# EAGLE design esp-01-qwiic-devbrd-v1.0 (EAGLE 9.6.2)
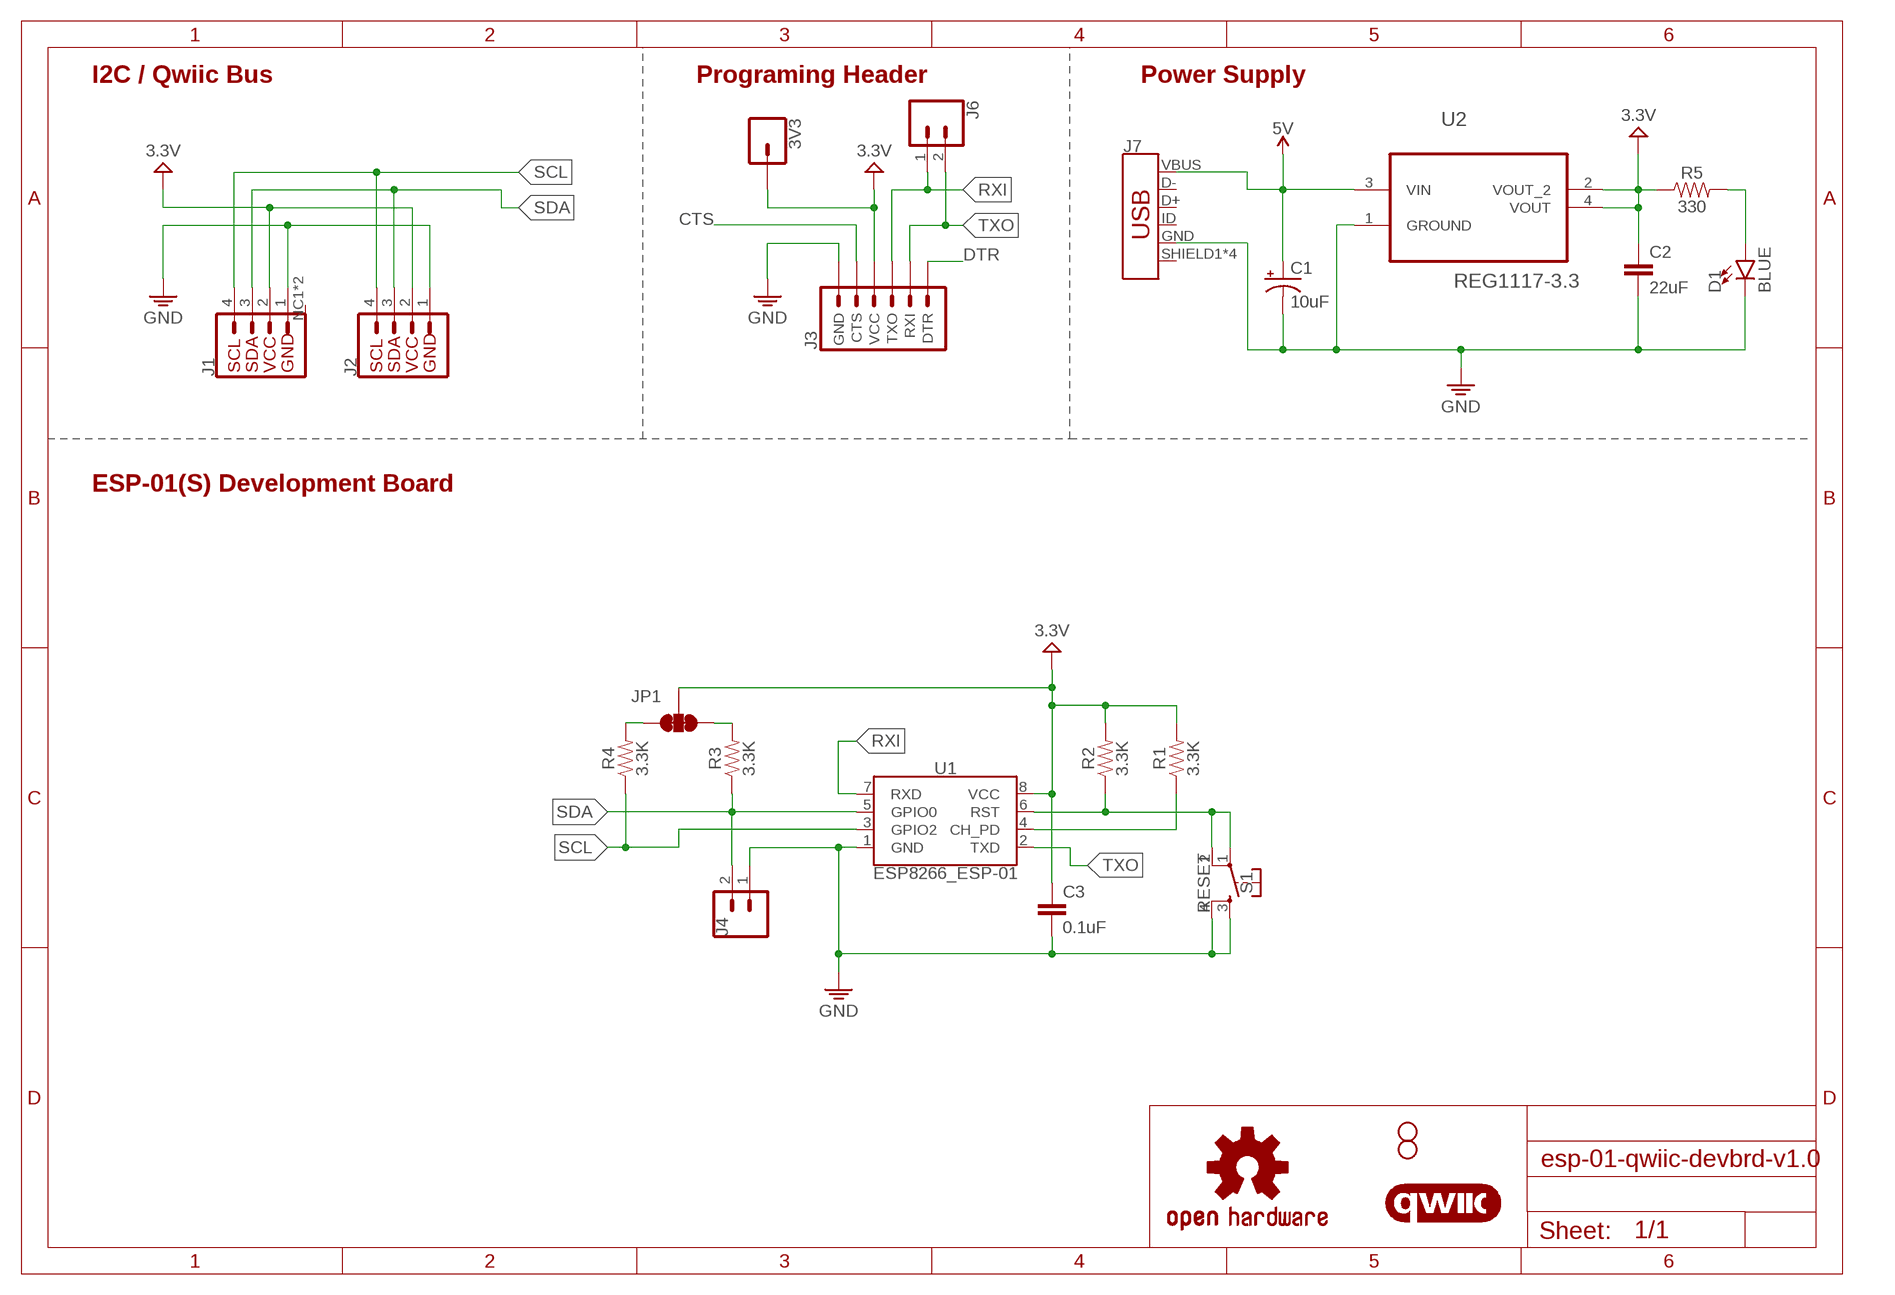
[diagram p0: schematic, sheet 1]

## Parts
3V3  CONN_01PTH_NO_SILK_YES_STOP  [1X01_NO_SILK]
C1  10uF  10UF-POLAR-EIA3216-16V-10%(TANT)  [EIA3216]
C2  22uF  22UF-0805-6.3V-20%  [0805]
C3  0.1uF  0.1UF-0603-25V-5%  [0603]
D1  BLUE  LED-BLUE0603  [LED-0603]
H1  STAND-OFF  [STAND-OFF]
H2  STAND-OFF  [STAND-OFF]
J1  QWIIC_CONNECTORJST04_1MM_RA_GND  [JST04_1MM_RA]
J2  I2C_STANDARD  [1X04]
J3  6_PIN_SERIAL_TARGETSILK  [6_PIN_SERIAL_TARGET_SIDE_W_SILK]
J4  CONN_02  [1X02]
J6  CONN_021X02_NO_SILK  [1X02_NO_SILK]
J7  USB_MICRO-B_FEMALE-SMT  [USB-B-MICRO-SMD]
JP1  JUMPER-SMT_3_2-NC_TRACE_SILK  [SMT-JUMPER_3_2-NC_TRACE_SILK]
LOGO1  OSHW-LOGOS  [OSHW-LOGO-S]
LOGO2  QWIIC_LOGO_6MM  [QWIIC_6MM]
R1  3.3K  RESISTOR0805  [0805]
R2  3.3K  RESISTOR0805  [0805]
R3  3.3K  RESISTOR0805  [0805]
R4  3.3K  RESISTOR0805  [0805]
R5  330  330OHM-0603-1/10W-1%  [0603]
S1  RESET  MOMENTARY-SWITCH-SPST-2-SMD-5.2MM  [TACTILE_SWITCH_SMD_5.2MM]
U1  ESP8266_ESP-01  [ESP8266_ESP-01]
U2  REG1117-3.3  [SOT230P700X180-4N]

## Nets
5V: C1.+ J7.VBUS U2.3(VIN)
CTS: J3.5(CTS)
DTR: J3.1(DTR)
GND: C1.- C2.2 C3.2 D1.C J1.1 J2.1 J3.6(GND) J4.1 J7.GND S1.3 S1.4 U1.1(GND) U2.1(GROUND)
N$3: R2.1 S1.1 S1.2 U1.6(RST)
N$4: D1.A R5.2
N$5: R1.1 U1.4(CH_PD)
N$6: JP1.3 R4.2
N$7: JP1.1 R3.2
RXI: J3.2(TXO) J6.1 U1.7(RXD)
SCL: J1.4 J2.4 R4.1 U1.3(GPIO2)
SDA: J1.3 J2.3 J4.2 R3.1 U1.5(GPIO0)
TXO: J3.3(RXI) J6.2 U1.2(TXD)
VCC: 3V3.1 C2.1 C3.1 J1.2 J2.2 J3.4(VCC) JP1.2 R1.2 R2.2 R5.1 U1.8(VCC) U2.2(VOUT_2) U2.4(VOUT) ; supply symbol labelled 3.3V
Unconnected: J1.NC1(SH) J1.NC2(SH) J7.D+ J7.D- J7.ID J7.SHIELD1(SHIELD) J7.SHIELD2(SHIELD) J7.SHIELD3(SHIELD) J7.SHIELD4(SHIELD)

## Notes on the sheet
- I2C / Qwiic Bus | Programing Header | Power Supply
- ESP-01(S) Development Board

## Library data of the parts
3V3 = SparkFun-Connectors:CONN_01: Single connection point. Often used as Generic Header-pin footprint for 0.1 inch spaced/style header connections On any of the 0.1 inch spaced packages, you can populate with these: Break Away Headers - Straight <https://www.sparkfun.com/products/116> (PRT-00116) Break Away Male Headers - Right Angle <https://www.sparkfun.com/products/553> (PRT-00553) Female Headers <https://www.sparkfun.com/products/115> (PRT-00115) Break Away Headers - Machine Pin <https://www.sparkfun.com/products/117> (PRT-00117) Break Away Female Headers - Swiss Machine Pin <https://www.sparkfun.com/products/743> (PRT-00743) This device is also useful as a general connection point to wire up your design to another part of your project. Our various solder wires solder well into these plated through hole pads. Hook-Up Wire - Assortment (Stranded, 22 AWG) <https://www.sparkfun.com/products/11375> (PRT-11375) Hook-Up Wire - Assortment (Solid Core, 22 AWG) <https://www.sparkfun.com/products/11367> (PRT-11367) View the entire wire category on our website here <https://www.sparkfun.com/categories/141> Special notes: SMTSO-256-ET is a "flush mount" nut for a 4-40 screw. We mostly use this on specialty testbeds; it is a nice way to connect hardware to your PCB at an adjustable hieght. Also note, the SNAP packages are for using a snappable style connector. We sell a baggie of snaps and they are also used on two LilyPad designs: Snap Assortment - 30 pack (male and female) <https://www.sparkfun.com/products/11347> (DEV-11347) LilyPad Arduino SimpleSnap <https://www.sparkfun.com/products/10941> (DEV-10941) LilyPad SimpleSnap Protoboard <https://www.sparkfun.com/products/10940> (DEV-10940)
C1 = SparkFun-Capacitors:10UF-POLAR: 10.0µF polarized capacitors A capacitor is a passive two-terminal electrical component used to store electrical energy temporarily in an electric field.; PROD_ID: CAP-00811
C2 = SparkFun-Capacitors:22UF: 22µF ceramic capacitors A capacitor is a passive two-terminal electrical component used to store electrical energy temporarily in an electric field.; PROD_ID: CAP-08402
C3 = SparkFun-Capacitors:0.1UF: 0.1µF ceramic capacitors A capacitor is a passive two-terminal electrical component used to store electrical energy temporarily in an electric field.; PROD_ID: CAP-08604
D1 = SparkFun-LED:LED-BLUE: Blue SMD LED Used in manufacturing of various products at SparkFun Packages: 0603 - SMD 0603 package [Product Link] <http://www.digikey.com/product-detail/en/SMLE12BC7TT86/511-1589-2-ND/1641808> 1206 - SMD1206 package [Product Link] <http://www.digikey.com/product-detail/en/lite-on-inc/LTST-C150TBKT/160-1643-1-ND/573584> SparkFun Products: ESP8266 Thing-Dev Board <https://www.sparkfun.com/products/13711> RedBoard <https://www.sparkfun.com/products/12757>; PROD_ID: DIO-08575
H1 H2 = SparkFun-Hardware:STAND-OFF: Stand Off Drill holes for mechanically mounting via screws, standoffs, etc. Note: Use the keepout ring to avoid running the screw head into surrounding components. Variant Overviews STAND-OFF - Mechanical footprint for a #4 phillips button head screw. STAND-OFF-TIGHT - Mechanical footprint for a #4 phillips button head screw, Example SparkFun Products Screw - Phillips Head (1/4", 4-40, 10 pack) <https://www.sparkfun.com/products/10453> (PRT-10453) Screw - Phillips Head (1/2", 4-40, 10 pack) <https://www.sparkfun.com/products/10452> (PRT-10452) Screw - Phillips Head (3/4", 4-40, 10 pack) <https://www.sparkfun.com/products/10451> (PRT-10451) Screw - Phillips Head (1", 4-40, 10 pack) <https://www.sparkfun.com/products/10450> (PRT-10450)
J1 = VinoRodrigues_Custom_Eagle:QWIIC_CONNECTOR: SparkFun I2C Standard Qwiic Connector An SMD 1mm pitch JST connector makes it easy and quick (get it? Qwiic?) to connect I2C devices to each other. The Qwiic system <http://www.sparkfun.com/qwiic> enables fast and solderless connection between popular platforms and various sensors and actuators. We carry 200mm <https://www.sparkfun.com/products/14204>, 100mm <https://www.sparkfun.com/products/14205>, 50mm <https://www.sparkfun.com/products/14206>, and breadboard friendly <https://www.sparkfun.com/products/14207> Qwiic cables. We also offer 10 pcs strips <https://www.sparkfun.com/products/14323> the SMD connectors.
J2 = SparkFun-Connectors:I2C_STANDARD: SparkFun I2C Standard Pinout Header SparkFun has standardized on a pinout for all I2C based sensor breakouts. This pinout allows I2C boards to be plugged directly into the headers on Arduino Uno compatible boards, and to be daisy chained easily. Example SparkFun Products: SparkFun Atmospheric Sensor Breakout - BME280 <https://www.sparkfun.com/products/13676> SparkFun Altitude/Pressure Sensor Breakout - MPL3115A2 <https://www.sparkfun.com/products/11084> SparkFun TOF Range Finder Sensor - VL6180 <https://www.sparkfun.com/products/12785>
J3 = SparkFun-Connectors:6_PIN_SERIAL_TARGET: 6-pin header connection for use with the "FTDI BASIC" pinout - TARGET SIDE. Also known as "Arduino Serial Program Header". It is used to mate with our FTDI Basic serial programmers using the Arduino IDE. Note, this device has "TARGET" in the name. It is intended to be used on a design that contains a target micro-controller that you wish to program. The "sister" device, named "CABLE" is inteneded to be used on a design that usually lives on the end of your USB cable and prvides the converter chip (FTDI232 or FTDI231x) to commnicate serial RX/TX. You can populate with some of these: Break Away Headers - Straight <https://www.sparkfun.com/products/116> (PRT-00116) For reference (or to suit your programming needs) check out these designs: SparkFun FTDI Basic Breakout - 5V <https://www.sparkfun.com/products/9716> (DEV-09716) SparkFun FTDI Basic Breakout - 3.3V <https://www.sparkfun.com/products/9873> (DEV-09873) SparkFun FTDI SmartBasic <https://www.sparkfun.com/products/12935> (DEV-12935) SparkFun Beefy 3 - FTDI Basic Breakout <https://www.sparkfun.com/products/13746> (DEV-13746)
J4 J6 = SparkFun-Connectors:CONN_02: Multi connection point. Often used as Generic Header-pin footprint for 0.1 inch spaced/style header connections On any of the 0.1 inch spaced packages, you can populate with these: Break Away Headers - Straight <https://www.sparkfun.com/products/116> (PRT-00116) Break Away Male Headers - Right Angle <https://www.sparkfun.com/products/553> (PRT-00553) Female Headers <https://www.sparkfun.com/products/115> (PRT-00115) Break Away Headers - Machine Pin <https://www.sparkfun.com/products/117> (PRT-00117) Break Away Female Headers - Swiss Machine Pin <https://www.sparkfun.com/products/743> (PRT-00743) For SCREWTERMINALS and SPRING TERMINALS visit here: Screw Terimnals on SparkFun.com <https://www.sparkfun.com/search/results?term=Screw+Terminals> (5mm/3.5mm/2.54mm spacing) This device is also useful as a general connection point to wire up your design to another part of your project. Our various solder wires solder well into these plated through hole pads. Hook-Up Wire - Assortment (Stranded, 22 AWG) <https://www.sparkfun.com/products/11375> (PRT-11375) Hook-Up Wire - Assortment (Solid Core, 22 AWG) <https://www.sparkfun.com/products/11367> (PRT-11367) View the entire wire category on our website here <https://www.sparkfun.com/categories/141> Special notes: Molex polarized connector foot print use with: PRT-08233 with associated crimp pins and housings. 2.54_SCREWTERM for use with PRT-10571. 3.5mm Screw Terminal footprints for PRT-08084 5mm Screw Terminal footprints for use with PRT-08432
J7 = VinoRodrigues_Custom_Eagle:USB_MICRO-B: USB Type Micro-B Connector Wurth Electronics: #629 105 136 821 <https://www.we-online.de/katalog/datasheet/629105136821.pdf>; PROD_ID: CONN-11752
JP1 = SparkFun-Jumpers:JUMPER-SMT_3_2-NC_TRACE: Normally closed trace jumper (2 of 2 connections) This jumper has a trace between all three pads so they are normally closed (NC). Use a razor knife to open the connection(s). For best results follow the IPC guidelines for cutting traces: Cutout at least 0.063 mm (0.005 in). Remove all loose material to clean up the cut area. Seal the cut with an approved epoxy. Reapply solder to reclose the connection(s).
LOGO1 = SparkFun-Aesthetics:OSHW-LOGO: Open-Source Hardware (OSHW) Logo This logo indicates the piece of hardware it is found on incorporates a OSHW license and/or adheres to the definition of open source hardware found here: http://freedomdefined.org/OSHW
LOGO2 = SparkFun-Aesthetics:QWIIC_LOGO: Qwiic Logos for placement on schematic and PCB. The 5.5mm silk logo is best for placing next to Qwiic connector.
R1-R4 = SparkFun-Resistors:RESISTOR: Generic Resistor Package
R5 = SparkFun-Resistors:330OHM: 330Ω resistor A resistor is a passive two-terminal electrical component that implements electrical resistance as a circuit element. Resistors act to reduce current flow, and, at the same time, act to lower voltage levels within circuits. - Wikipedia; PROD_ID: RES-00818
S1 = SparkFun-Switches:MOMENTARY-SWITCH-SPST-2: Momentary Switch (Pushbutton) - SPST - Two Circuits Normally-open (NO) SPST momentary switches (buttons, pushbuttons). Schematic symbol includes two switch circuits. Variants SMD-4.6MMX2.8MM - 4.60mm x 2.80mm Tactile Momentary Button Switch - Used on SparkFun SAMD21 Mini Breakout <https://www.sparkfun.com/products/13664> SMD-5.2MM - Mini Pushbutton Switch - SMD <https://www.sparkfun.com/products/8720> - Used on Arduino Pro Mini <https://www.sparkfun.com/products/11114>; PROD_ID: SWCH-08247; SF_SKU: COM-08720
U1 = VinoRodrigues_Custom_Eagle:ESP8266_ESP-01: ESP8266 ESP-01 Module The ESP8266 WiFi Module is a self contained SOC with integrated TCP/IP protocol stack that can give any microcontroller access to your WiFi network. The ESP8266 is capable of either hosting an application or offloading all Wi-Fi networking functions from another application processor. Each ESP8266 module comes pre-programmed with an AT command set firmware, meaning, you can simply hook this up to your Arduino device and get about as much WiFi-ability as a WiFi Shield offers (and that’s just out of the box)! The ESP8266 module is an extremely cost effective board with a huge, and ever growing, community. This module has a powerful enough on-board processing and storage capability that allows it to be integrated with the sensors and other application specific devices through its GPIOs with minimal development up-front and minimal loading during runtime. Its high degree of on-chip integration allows for minimal external circuitry, including the front-end module, is designed to occupy minimal PCB area. The ESP8266 supports APSD for VoIP applications and Bluetooth co-existance interfaces, it contains a self-calibrated RF allowing it to work under all operating conditions, and requires no external RF parts. SparkFun Product Page <https://www.sparkfun.com/products/13678>; SF_ID: WRL-13678
U2 = Texas Instruments_By_element14_Batch_1:REG1117-3.3: Low Dropout Positive Regulator; MPN: REG1117-3.3; OC_FARNELL: 1212355; OC_NEWARK: 35C1963; PACKAGE: SOT-223-4; SUPPLIER: Texas Instruments

## Board
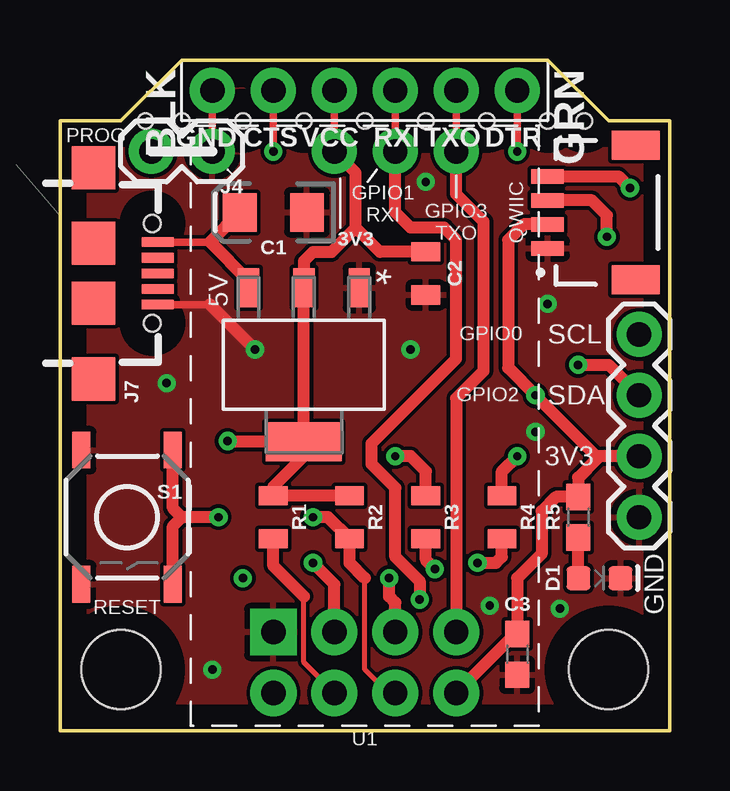
[diagram p1: board, top side]
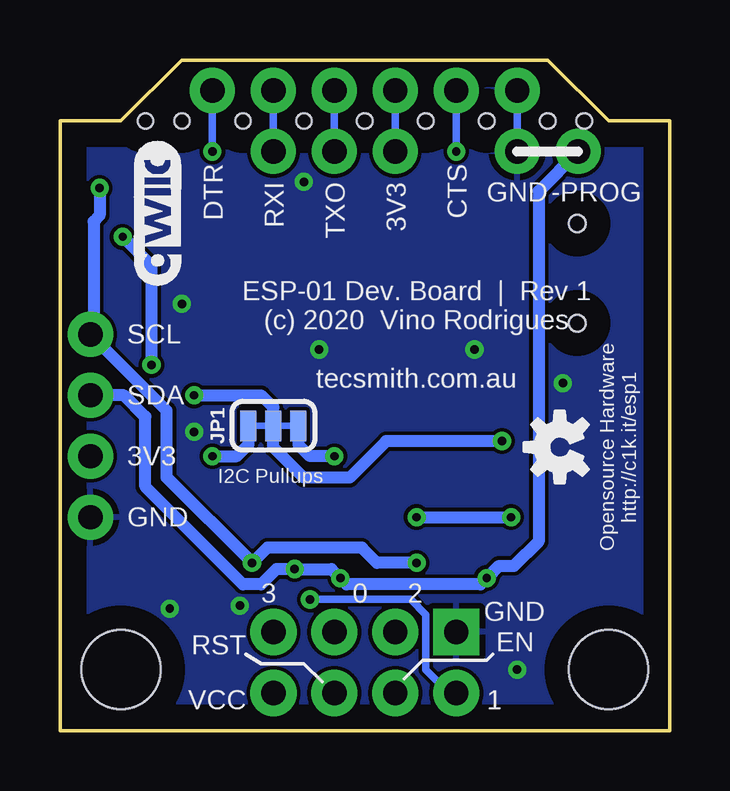
[diagram p2: board, bottom side, seen from below]

Size 25.4 x 27.94 mm. Coordinates in mm from the lower left corner, seen from the top.
Outline: 0,0 0,25.4 2.54,25.4 5.08,27.94 20.32,27.94 22.86,25.4 25.4,25.4 25.4,0 0,0
Copper layers (1*16): Top 0.035mm / dielectric 1.5mm / Bottom 0.035mm
Design rules "default": minimum track width 6mil, minimum drill 0.35mm, track to track 6mil, track to pad 6mil, pad to pad 6mil, via to via 6mil, smd to smd 6mil, copper to edge 40mil, drill to drill 6mil, minimum pad ring 10mil, minimum via ring 8mil, stop-mask expansion 4mil, vias tented up to drill 0mil, thermal gap 10mil
Holes 0.64 mm at 5.08,25.4 15.24,25.4 3.56,25.4 7.62,25.4 17.78,25.4 12.7,25.4 20.32,25.4 10.16,25.4 21.84,25.4

### Footprints (pad centres in the part's own frame; a part is rotated, then mirrored left to right if it is on the bottom)
1X01_NO_SILK = drill 1.016 pad 1.88: 1 0,0
EIA3216 = smd 1.4 x 1.6: + 1.4,0; - -1.4,0
0805 = smd 0.8 x 1.2: 1 -0.9,0; 2 0.9,0
0603 = smd 1.1 x 1: 1 -0.85,0; 2 0.85,0
LED-0603 = smd 1 x 1: A -0.877,0; C 0.877,0
STAND-OFF = hole 3.302: 0,0
JST04_1MM_RA = smd 0.6 x 1.35: 1 -1.5,0; 2 -0.5,0; 3 0.5,0; 4 1.5,0 | smd 1.2 x 2: NC1 2.8,-3.675; NC2 -2.8,-3.675
1X04 = drill 1.016 pad 1.88: 1 0,0; 2 2.54,0; 3 5.08,0; 4 7.62,0
6_PIN_SERIAL_TARGET_SIDE_W_SILK = drill 1.016 pad 1.88: 1 -6.35,0; 2 -3.81,0; 3 -1.27,0; 4 1.27,0; 5 3.81,0; 6 6.35,0
1X02 = drill 1.016 pad 1.88: 1 0,0; 2 2.54,0
1X02_NO_SILK = drill 1.016 pad 1.88: 1 0,0; 2 2.54,0
USB-B-MICRO-SMD = smd 0.4 x 1.35: D+ 0,2.675; D- -0.65,2.675; GND 1.3,2.675; ID 0.65,2.675; VBUS -1.3,2.675 | smd 1.8 x 1.8: SHIELD1 -4.4,0; SHIELD2 -1.25,0; SHIELD3 1.25,0; SHIELD4 4.4,0 | hole 0.7: 2.075,2.45; -2.075,2.45
SMT-JUMPER_3_2-NC_TRACE_SILK = smd 0.66 x 1.27: 1 -1.041,0; 2 0,0; 3 1.041,0
TACTILE_SWITCH_SMD_5.2MM = smd 1.524 x 0.762: 1 -2.794,1.905; 2 2.794,1.905; 3 -2.794,-1.905; 4 2.794,-1.905
ESP8266_ESP-01 = drill 1.016 pad 1.93 square: 1 -3.81,1.316 | drill 1.016 pad 1.93: 2 -3.81,-1.224; 3 -1.27,1.316; 4 -1.27,-1.224; 5 1.27,1.316; 6 1.27,-1.224; 7 3.81,1.316; 8 3.81,-1.224
SOT230P700X180-4N = smd 1.626 x 0.889: 1 -3.2,2.311; 2 -3.2,0; 3 -3.2,-2.311 | smd 1.626 x 3.175: 4 3.2,0

### Placement (x,y rotation side)
3V3  11.43,24.13 0 top
C1  8.89,21.59 180 top
C2  15.24,19.05 270 top
C3  19.05,3.17 270 top
D1  22.48,6.35 0 top
H1  22.86,2.54 0 top
H2  2.54,2.54 0 top
J1  20.32,21.59 90 top
J2  24.13,8.89 90 top
J3  12.7,26.67 180 top
J4  6.35,24.13 180 top
J6  16.51,24.13 180 top
J7  1.4,19.05 270 top
JP1  16.51,12.7 180 bottom
LOGO1  4.57,11.81 90 bottom
LOGO2  21.34,21.59 90 bottom
R1  8.89,8.89 90 top
R2  12.06,8.89 90 top
R3  15.24,8.89 90 top
R4  18.41,8.89 90 top
R5  21.59,8.89 270 top
S1  2.79,8.89 270 top
U1  12.7,2.79 0 top
U2  10.16,15.24 270 top

### Tracks (layer width: path | path; a pad name or v marks a point on that pad's centre or on a via)
5V
  Top 0.305: J7.VBUS 6.25,20.35 | 7.85,18.75 U2.3
  Top 0.508: C1.+ 6.25,20.35 7.85,18.75
CTS  (via drill 0.35)
  Top 0.305: v8.89,24.13 J3.5
  Bottom 0.305: v8.89,24.13 J3.5
DTR  (via drill 0.35)
  Top 0.305: v19.05,24.13 J3.1
  Bottom 0.305: v19.05,24.13 J3.1
GND  (via drill 0.35)
  Top 0.305: J7.GND 6.25,17.75 | J4.1 J3.6
  Top 0.508: 6.25,17.75 v8.13,15.88
  Bottom 0.305: J3.6 J4.1
  other vias: 14.61,15.88 6.35,2.54 4.45,14.48 17.91,5.21 20.83,5.08 15.24,22.86 20.32,17.78 19.81,12.45
  pour Top: 0,0 0,14.61 0,25.4 2.54,25.4 5.08,27.94 20.32,27.94 22.86,25.4 25.4,25.4 25.4,0
  pour Bottom: 0,0 0,25.4 2.54,25.4 5.08,27.94 20.32,27.94 22.86,25.4 25.4,25.4 25.4,0
N$3  (via drill 0.35)
  Top 0.203: U1.6 13.67,1.57 12.7,2.54 12.7,6.35
  Top 0.508: 12.7,6.35 12.06,6.99 R2.1 11.16,8.89 v10.54,8.89 | v6.6,8.89 5.08,8.89 | 5.08,8.89 4.7,9.27 S1.1 | S1.2 4.7,8.51 5.08,8.89
  Bottom 0.508: v10.54,8.89 v6.6,8.89
N$4
  Top 0.152: D1.A 21.59,6.36
  Top 0.508: 21.59,6.36 R5.2
N$5
  Top 0.203: U1.4 10.16,2.84 10.16,5.59
  Top 0.508: 10.16,5.59 8.89,6.86 R1.1
N$6  (via drill 0.35)
  Top 0.508: R4.2 18.41,10.79 v19.05,11.43
  Bottom 0.508: v19.05,11.43 18.03,11.43 17.55,11.91 JP1.3
N$7  (via drill 0.35)
  Top 0.508: v13.97,11.43 14.61,11.43 15.24,10.79 R3.2
  Bottom 0.508: JP1.1 15.47,11.91 14.99,11.43 v13.97,11.43
RXI
  Top 0.305: J6.1 J3.2
  Top 0.508: J6.1 16.51,22.35 17.65,21.21 17.65,14.99 16.51,13.84 U1.7
  Bottom 0.305: J6.1 J3.2
SCL  (via drill 0.35)
  Top 0.508: U1.3 11.43,6.1 v10.54,6.99 | R4.1 18.41,7.24 18.16,6.99 v17.4,6.99 | v23.75,22.61 23.27,23.09 J1.4
  Bottom 0.508: v10.54,6.99 12.19,6.99 12.83,7.62 16.76,7.62 v17.4,6.99 20.95,10.54 20.95,13.34 J2.4 24,16.64 24,21.21 23.75,21.46 v23.75,22.61
SDA  (via drill 0.35)
  Top 0.508: v15.62,6.73 15.24,7.11 R3.1 | U1.5 13.97,5.33 13.72,5.59 v13.72,6.35 | v22.79,20.57 22.79,21.46 22.16,22.09 J1.3 | v21.59,15.24 22.86,15.24 J2.3
  Bottom 0.508: J2.3 22.73,13.97 21.84,13.08 21.84,10.16 17.78,6.1 17.02,6.1 16.38,6.73 v15.62,6.73 14.1,6.73 v13.72,6.35 13.46,6.1 7.87,6.1 v7.62,6.35 7.11,6.86 6.48,6.86 5.46,7.87 5.46,22.48 J4.2 | v22.79,20.57 21.59,19.38 v21.59,15.24
TXO  (via drill 0.35)
  Top 0.305: J6.2 J3.3
  Top 0.508: v14.99,5.46 14.99,6.22 13.97,7.24 13.97,10.11 12.98,11.1 12.98,11.97 16.51,15.49 16.51,20.45 16,20.95 14.61,20.95 13.97,21.59 J6.2
  Bottom 0.305: J6.2 J3.3 | U1.2 9.19,1.57 10.16,2.54 10.16,4.83 10.79,5.46 v14.99,5.46
VCC  (via drill 0.35)
  Top 0.152: 7.01,12.04 v6.99,12.06
  Top 0.305: 10.16,19.05 U2.2 | 3V3.1 J3.4 | 22.35,11.43 22.35,11.3 | 18.96,4.03 C3.1 | 10.16,11.43 U2.4
  Top 0.508: J2.2 22.35,11.43 v19.81,13.97 18.67,15.11 18.67,20.45 19.31,21.09 J1.2 | 22.35,11.3 21.59,10.54 R5.1 20.66,9.74 20.07,9.14 20.07,7.37 19.05,6.35 C3.1 | 12.32,20.95 11.3,19.94 10.54,19.94 10.16,19.56 10.16,19.05 | 3V3.1 12.32,23.24 12.32,20.95 | C2.1 13.32,19.95 12.32,20.95 | R2.2 R1.2 8.89,10.16 10.16,11.43 | U1.8 18.96,4.03 | U2.2 U2.4 7.01,12.04
  Bottom 0.305: 3V3.1 J3.4
  Bottom 0.508: v19.81,13.97 17.02,13.97 16.51,13.46 JP1.2 16.51,11.81 15.24,10.54 13.34,10.54 11.81,12.06 v6.99,12.06

### Text on the board
tPlace: 5V | SCL | SDA | 3V3 | GND
bPlace: CTS | DTR | -PROG | GND | 3V3 | TXO | RXI | ESP-01 Dev. Board | Rev 1 / (c) 2020 Vino Rodrigues / / tecsmith.com.au | SCL | SDA | Opensource Hardware / http://c1k.it/esp1 | I2C Pullups | 3V3 | GND | GND | 2 | 0 | 3 | EN | RST | 1 | VCC
tNames: PROG | GPIO1 / RXI | GPIO3 / TXO | QWIIC | GPIO0 | GPIO2 | RESET